# EAGLE schematic circuit-board (EAGLE 8.6.3)
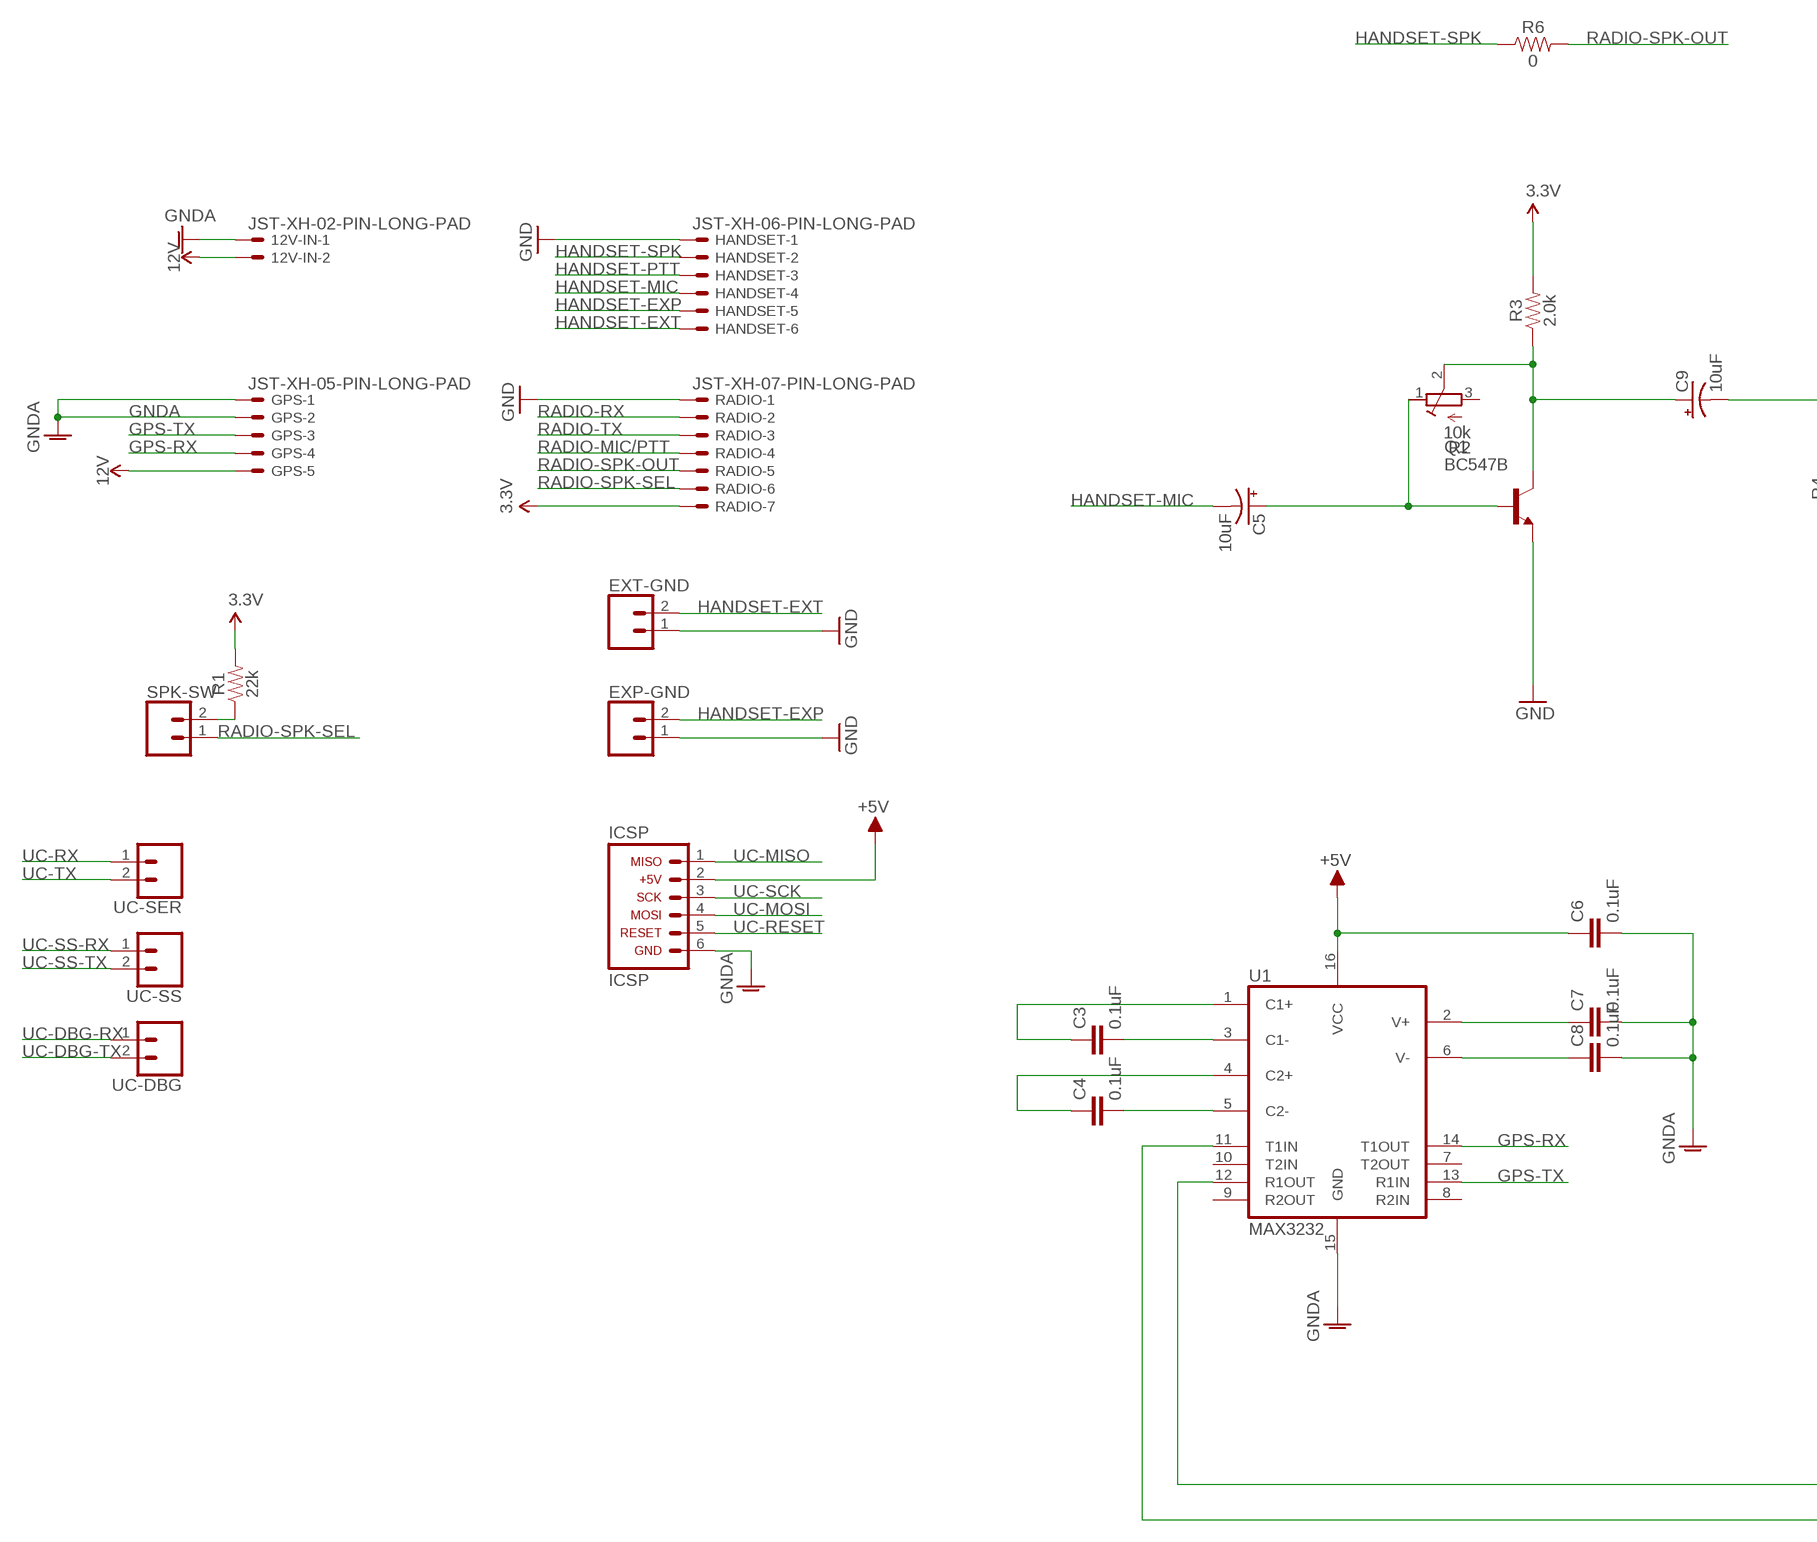
[diagram p0: schematic, sheet 1, part 1 of 2]
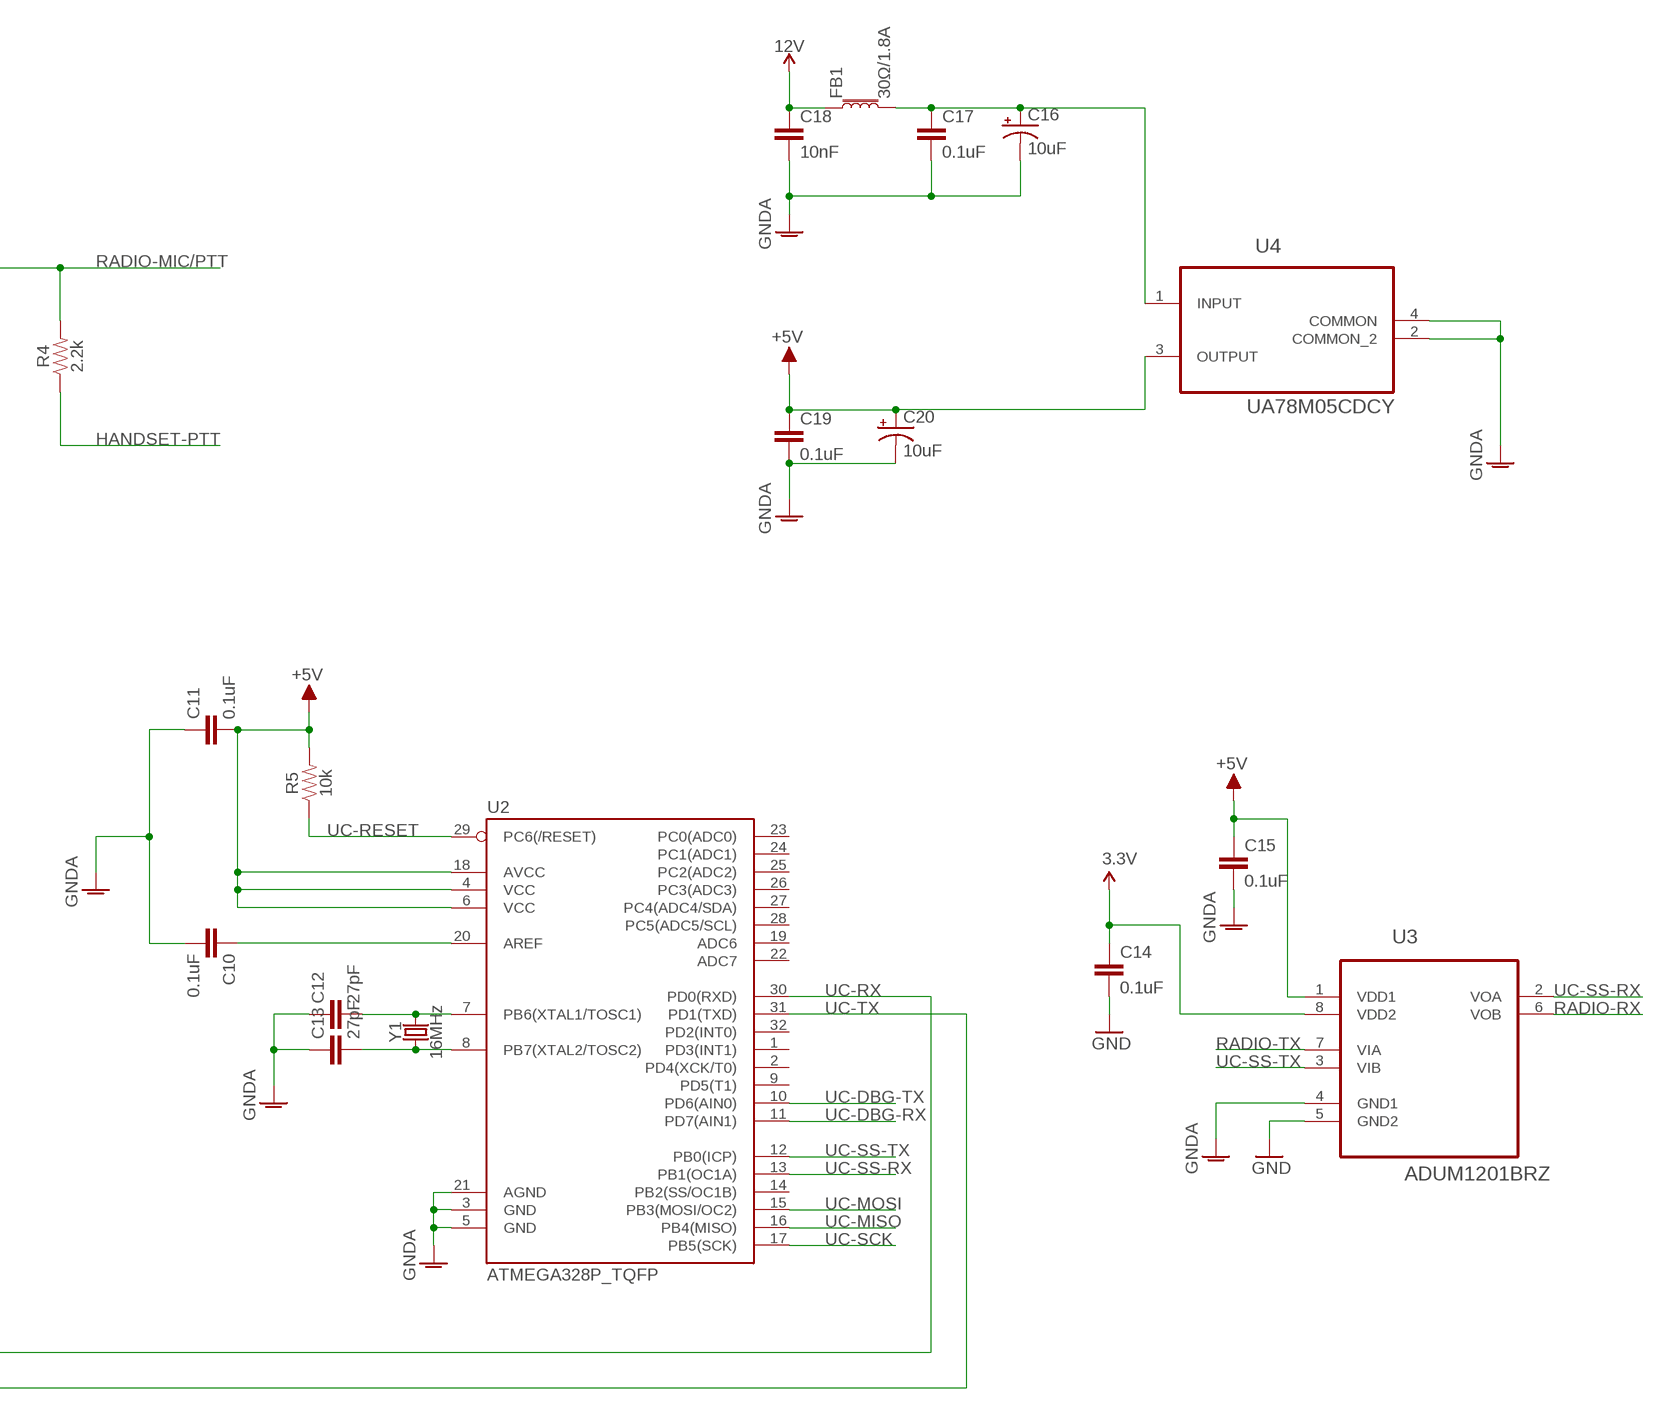
[diagram p1: schematic, sheet 1, part 2 of 2]

## Parts
12V-IN  JST-XH-02-PIN-LONG-PAD  [JST-XH-02-PACKAGE-LONG-PAD]
C3  0.1uF  0.1UF-0603-25V-5%  [0603]
C4  0.1uF  0.1UF-0603-25V-5%  [0603]
C5  10uF  CPOL-USE2.5-5  [E2,5-5]
C6  0.1uF  0.1UF-0603-25V-5%  [0603]
C7  0.1uF  0.1UF-0603-25V-5%  [0603]
C8  0.1uF  0.1UF-0603-25V-5%  [0603]
C9  10uF  CPOL-USE2.5-5  [E2,5-5]
C10  0.1uF  0.1UF-0603-25V-5%  [0603]
C11  0.1uF  0.1UF-0603-25V-5%  [0603]
C12  27pF  27PF-0603-50V-5%  [0603]
C13  27pF  27PF-0603-50V-5%  [0603]
C14  0.1uF  0.1UF-0603-25V-5%  [0603]
C15  0.1uF  0.1UF-0603-25V-5%  [0603]
C16  10uF  CPOL-USE2.5-5  [E2,5-5]
C17  0.1uF  0.1UF-0603-25V-5%  [0603]
C18  10nF  10NF-0603-50V-10%  [0603]
C19  0.1uF  0.1UF-0603-25V-5%  [0603]
C20  10uF  CPOL-USE2.5-5  [E2,5-5]
EXP-GND  CONN_02  [1X02]
EXT-GND  CONN_02  [1X02]
FB1  30Ω/1.8A  FERRITE_BEAD-0603  [0603]
GPS  JST-XH-05-PIN-LONG-PAD  [JST-XH-05-PACKAGE-LONG-PAD]
HANDSET  JST-XH-06-PIN-LONG-PAD  [JST-XH-06-PACKAGE-LONG-PAD]
ICSP  ARDUINO_CONN-ICSP  [CONN-2X03]
Q1  BC547B  [TO92]
R1  22k  22KOHM-0603-1/10W-1%  [0603]
R2  10k  R-TRIMMT93YA  [RTRIMT93YA]
R3  2.0k  2.0KOHM-0603-1/10W-5%  [0603]
R4  2.2k  2.2KOHM-0603-1/10W-1%  [0603]
R5  10k  10KOHM-0603-1/10W-1%  [0603]
R6  0  0OHM-0603-1/10W-5%  [0603]
RADIO  JST-XH-07-PIN-LONG-PAD  [JST-XH-07-PACKAGE-LONG-PAD]
SPK-SW  CONN_02  [1X02]
U1  MAX3232  MAX2323SOIC16  [SO16]
U2  ATMEGA328P_TQFP  [TQFP32-08]
U3  ADUM1201BRZ  [SOIC127P600X175-8N]
U4  UA78M05CDCY  [SOT230P700X180-4N]
UC-DBG  CONN_02  [1X02]
UC-SER  CONN_02  [1X02]
UC-SS  CONN_02  [1X02]
Y1  16MHz  CRYSTAL-16MHZPTH-HC49US  [HC49US]

## Nets
3.3V: C14.1 R1.2 R3.2 RADIO.7 U3.8(VDD2)
12V: 12V-IN.2 C18.1 FB1.1 GPS.5
+5V: C6.1 C11.2 C15.1 C19.1 C20.+ ICSP.2 R5.2 U1.16(VCC) U2.4(VCC) U2.6(VCC) U2.18(AVCC) U3.1(VDD1) U4.3(OUTPUT)
GND: C14.2 EXP-GND.1 EXT-GND.1 HANDSET.1 Q1.1(E) RADIO.1 U3.5(GND2)
GNDA: 12V-IN.1 C6.2 C7.2 C8.2 C10.2 C11.1 C12.1 C13.1 C15.2 C16.- C17.2 C18.2 C19.2 C20.- GPS.1 GPS.2 ICSP.6 U1.15(GND) U2.3(GND) U2.5(GND) U2.21(AGND) U3.4(GND1) U4.2(COMMON_2) U4.4(COMMON)
GPS-RX: GPS.4 U1.14(T1OUT)
GPS-TX: GPS.3 U1.13(R1IN)
HANDSET-EXP: EXP-GND.2 HANDSET.5
HANDSET-EXT: EXT-GND.2 HANDSET.6
HANDSET-MIC: C5.- HANDSET.4
HANDSET-PTT: HANDSET.3 R4.1
HANDSET-SPK: HANDSET.2 R6.1
N$1: C16.+ C17.1 FB1.2 U4.1(INPUT)
N$3: C9.+ Q1.3(C) R2.2(S) R3.1
N$4: C5.+ Q1.2(B) R2.1(E)
N$12: R1.1 SPK-SW.2
N$15: C3.2 U1.3(C1-)
N$16: C3.1 U1.1(C1+)
N$17: C4.2 U1.5(C2-)
N$18: C4.1 U1.4(C2+)
N$20: C7.1 U1.2(V+)
N$21: C8.1 U1.6(V-)
N$22: C10.1 U2.20(AREF)
N$23: C12.2 U2.7(PB6(XTAL1/TOSC1)) Y1.2
N$24: C13.2 U2.8(PB7(XTAL2/TOSC2)) Y1.1
RADIO-MIC/PTT: C9.- R4.2 RADIO.4
RADIO-RX: RADIO.2 U3.6(VOB)
RADIO-SPK-OUT: R6.2 RADIO.5
RADIO-SPK-SEL: RADIO.6 SPK-SW.1
RADIO-TX: RADIO.3 U3.7(VIA)
UC-DBG-RX: U2.11(PD7(AIN1)) UC-DBG.1
UC-DBG-TX: U2.10(PD6(AIN0)) UC-DBG.2
UC-MISO: ICSP.1 U2.16(PB4(MISO))
UC-MOSI: ICSP.4 U2.15(PB3(MOSI/OC2))
UC-RESET: ICSP.5 R5.1 U2.29(PC6(/RESET))
UC-RX: U1.12(R1OUT) U2.30(PD0(RXD)) UC-SER.1
UC-SCK: ICSP.3 U2.17(PB5(SCK))
UC-SS-RX: U2.13(PB1(OC1A)) U3.2(VOA) UC-SS.1
UC-SS-TX: U2.12(PB0(ICP)) U3.3(VIB) UC-SS.2
UC-TX: U1.11(T1IN) U2.31(PD1(TXD)) UC-SER.2
Unconnected: R2.3(A) U1.7(T2OUT) U1.8(R2IN) U1.9(R2OUT) U1.10(T2IN) U2.1(PD3(INT1)) U2.2(PD4(XCK/T0)) U2.9(PD5(T1)) U2.14(PB2(SS/OC1B)) U2.19(ADC6) U2.22(ADC7) U2.23(PC0(ADC0)) U2.24(PC1(ADC1)) U2.25(PC2(ADC2)) U2.26(PC3(ADC3)) U2.27(PC4(ADC4/SDA)) U2.28(PC5(ADC5/SCL)) U2.32(PD2(INT0))

## Library data of the parts
12V-IN = Rembrandt Electronics - JST XH Connectors v1-0:JST-XH-02-PIN: JST XH Connector 2 Pin Wire to board connector. Pitch: 2,54 mm, (0.100") Number of pins: 2 Created by Rembrandt Electronics www.rembrandtelectronics.com
C3 C4 C6-C8 C10 C11 C14 C15 C17 C19 = SparkFun-Capacitors:0.1UF: 0.1µF ceramic capacitors A capacitor is a passive two-terminal electrical component used to store electrical energy temporarily in an electric field.; PROD_ID: CAP-08604
C5 C9 C16 C20 = adafruit:CPOL-US: POLARIZED CAPACITOR, American symbol
C12 C13 = SparkFun-Capacitors:27PF: 27pF ceramic capacitors A capacitor is a passive two-terminal electrical component used to store electrical energy temporarily in an electric field.; PROD_ID: CAP-09989
C18 = SparkFun-Capacitors:10NF: 0.01uF/10nF/10,000pF ceramic capacitors A capacitor is a passive two-terminal electrical component used to store electrical energy temporarily in an electric field. CAP-09321; PROD_ID: CAP-00867
EXP-GND EXT-GND SPK-SW UC-DBG UC-SER UC-SS = SparkFun-Connectors:CONN_02: Multi connection point. Often used as Generic Header-pin footprint for 0.1 inch spaced/style header connections On any of the 0.1 inch spaced packages, you can populate with these: Break Away Headers - Straight <https://www.sparkfun.com/products/116> (PRT-00116) Break Away Male Headers - Right Angle <https://www.sparkfun.com/products/553> (PRT-00553) Female Headers <https://www.sparkfun.com/products/115> (PRT-00115) Break Away Headers - Machine Pin <https://www.sparkfun.com/products/117> (PRT-00117) Break Away Female Headers - Swiss Machine Pin <https://www.sparkfun.com/products/743> (PRT-00743) For SCREWTERMINALS and SPRING TERMINALS visit here: Screw Terimnals on SparkFun.com <https://www.sparkfun.com/search/results?term=Screw+Terminals> (5mm/3.5mm/2.54mm spacing) This device is also useful as a general connection point to wire up your design to another part of your project. Our various solder wires solder well into these plated through hole pads. Hook-Up Wire - Assortment (Stranded, 22 AWG) <https://www.sparkfun.com/products/11375> (PRT-11375) Hook-Up Wire - Assortment (Solid Core, 22 AWG) <https://www.sparkfun.com/products/11367> (PRT-11367) View the entire wire category on our website here <https://www.sparkfun.com/categories/141> Special notes: Molex polarized connector foot print use with: PRT-08233 with associated crimp pins and housings. 2.54_SCREWTERM for use with PRT-10571. 3.5mm Screw Terminal footprints for PRT-08084 5mm Screw Terminal footprints for use with PRT-08432
FB1 = SparkFun-Coils:FERRITE_BEAD: Ferrite Bead (blocks, cores, rings, chokes, etc.) Inductor with layers of ferrite used to suppress high frequencies. Often used to isolate high frequency noise. SparkFun Products: IOIO-OTG - V2.2 <https://www.sparkfun.com/products/13613> SparkFun SAMD21 Mini Breakout <https://www.sparkfun.com/products/13664> SparkFun 6 Degrees of Freedom Breakout - LSM6DS3 <https://www.sparkfun.com/products/13339> SparkFun SAMD21 Dev Breakout <https://www.sparkfun.com/products/13672>; PROD_ID: NDUC-07859
GPS = Rembrandt Electronics - JST XH Connectors v1-0:JST-XH-05-PIN: JST XH Connector 2 Pin Wire to board connector. Pitch: 2,54 mm, (0.100") Number of pins: 5 Created by Rembrandt Electronics www.rembrandtelectronics.com
HANDSET = Rembrandt Electronics - JST XH Connectors v1-0:JST-XH-06-PIN: JST XH Connector 2 Pin Wire to board connector. Pitch: 2,54 mm, (0.100") Number of pins: 6 Created by Rembrandt Electronics www.rembrandtelectronics.com
ICSP = arduino_jw:ARDUINO_CONN-ICSP: Arduino ICSP I/O Header This is the ICSP I/O header on the Arduino Uno R3. This connector is labeled with the following pin assignments: MISO +5V SCK MOSI RESET GND NOTE: Be sure you install this connector with the correct orientation on your PCB layout. Pin 1 has a square pad to assist with orientation.
Q1 = transistor-npn:BC547*: NPN Transistor
R1 = SparkFun-Resistors:22KOHM: 22kΩ resistor A resistor is a passive two-terminal electrical component that implements electrical resistance as a circuit element. Resistors act to reduce current flow, and, at the same time, act to lower voltage levels within circuits. - Wikipedia; PROD_ID: RES-07853
R2 = resistor:R-TRIMM: Trimm resistor
R3 = SparkFun-Resistors:2.0KOHM: 2kΩ resistor A resistor is a passive two-terminal electrical component that implements electrical resistance as a circuit element. Resistors act to reduce current flow, and, at the same time, act to lower voltage levels within circuits. - Wikipedia; PROD_ID: RES-08296
R4 = SparkFun-Resistors:2.2KOHM: 2.2kΩ resistor A resistor is a passive two-terminal electrical component that implements electrical resistance as a circuit element. Resistors act to reduce current flow, and, at the same time, act to lower voltage levels within circuits. - Wikipedia; PROD_ID: RES-08272
R5 = SparkFun-Resistors:10KOHM: 10kΩ resistor A resistor is a passive two-terminal electrical component that implements electrical resistance as a circuit element. Resistors act to reduce current flow, and, at the same time, act to lower voltage levels within circuits. - Wikipedia; PROD_ID: RES-00824
R6 = SparkFun-Resistors:0OHM: 0Ω resistor A resistor is a passive two-terminal electrical component that implements electrical resistance as a circuit element. Resistors act to reduce current flow, and, at the same time, act to lower voltage levels within circuits. - Wikipedia; PROD_ID: RES-08609
RADIO = Rembrandt Electronics - JST XH Connectors v1-0:JST-XH-07-PIN: JST XH Connector 2 Pin Wire to board connector. Pitch: 2,54 mm, (0.100") Number of pins: 7 Created by Rembrandt Electronics www.rembrandtelectronics.com
U1 = SparkFun-IC-Comms:MAX2323: RS232 Transceiver This part covers 232 drivers that are compatible with the MAX3232. Sipex SP3232EB Datasheet <http://cdn.sparkfun.com/datasheets/Components/General%20IC/SP3232EBCA-L.pdf> SparkFun Products SOIC component <https://www.sparkfun.com/products/589> (COM-00589 / IC-08171) Retired DIP component (COM-00316 / IC-08446) SparkFun Transceiver Breakout - MAX3232 <https://www.sparkfun.com/products/11189> (BOB-11189) SparkFun XBee Explorer Serial <https://www.sparkfun.com/products/13225> (WRL-13225); PROD_ID: IC-08171
U2 = SparkFun-IC-Microcontroller:ATMEGA328P_TQFP: Popular 328P in QFP Storefront component: ATmega328 - TQFP <https://www.sparkfun.com/products/13448> (COM-13448) Datasheet <http://www.sparkfun.com/datasheets/Components/SMD/ATMega328.pdf> SparkFun Products SparkFun RedBoard - Programmed with Arduino <https://www.sparkfun.com/products/12757> (DEV-12757) Arduino Pro Mini 328 - 5V/16MHz <https://www.sparkfun.com/products/11113> (DEV-11113) Arduino Pro Mini 328 - 3.3V/8MHz <https://www.sparkfun.com/products/11114> (DEV-11114) SparkFun OpenLog <https://www.sparkfun.com/products/13712> (DEV-13712) SparkFun MicroView - OLED Arduino Module <https://www.sparkfun.com/products/12923> (DEV-12923) SparkFun Digital Sandbox <https://www.sparkfun.com/products/12651> (DEV-12651) SparkFun PicoBoard <https://www.sparkfun.com/products/11888> (WIG-11888) Arduino Fio <https://www.sparkfun.com/products/10116> (DEV-10116) LilyPad Arduino 328 Main Board <https://www.sparkfun.com/products/13342> (DEV-13342) SparkFun RedStick <https://www.sparkfun.com/products/13741> (DEV-13741) LilyPad MP3 <https://www.sparkfun.com/products/11013> (DEV-11013) LilyPad Arduino SimpleSnap <https://www.sparkfun.com/products/10941> (DEV-10941) SparkFun Stepoko <https://www.sparkfun.com/products/13899> (ROB-13899) SparkFun Geiger Counter <https://www.sparkfun.com/products/11345> (SEN-11345) SparkFun EL Sequencer <https://www.sparkfun.com/products/12781> (COM-12781) Arduino Pro 328 - 5V/16MHz <https://www.sparkfun.com/products/10915> (DEV-10915) CryptoCape <https://www.sparkfun.com/products/12773> (DEV-12773) SparkFun IR Thermometer Evaluation Board - MLX90614 <https://www.sparkfun.com/products/10740> (SEN-10740) SparkFun RedBot Mainboard <https://www.sparkfun.com/products/12097> (ROB-12097) Arduino Pro 328 - 3.3V/8MHz <https://www.sparkfun.com/products/10914> (DEV-10914) SparkFun Block for Intel® Edison - Arduino <https://www.sparkfun.com/products/13036> (DEV-13036) SparkFun Simon Says - Surface Mount Soldering Kit <https://www.sparkfun.com/products/10935> (KIT-10935) SparkFun 7-Segment Serial Display - Red <https://www.sparkfun.com/products/11441> (COM-11441) SparkFun 7-Segment Serial Display - White <https://www.sparkfun.com/products/11629> (COM-11629) SparkFun 7-Segment Serial Display - Yellow <https://www.sparkfun.com/products/11443> (COM-11443) SparkFun 7-Segment Serial Display - Kelly Green <https://www.sparkfun.com/products/11440> (COM-11440) SparkFun 7-Segment Serial Display - Blue <https://www.sparkfun.com/products/11442> (COM-11442) SparkFun OpenSegment Serial Display - 20mm (Blue) <https://www.sparkfun.com/products/11647> (COM-11647) SparkFun OpenSegment Serial Display - 20mm (Green) <https://www.sparkfun.com/products/11646> (COM-11646) SparkFun OpenSegment Serial Display - 20mm (White) <https://www.sparkfun.com/products/11648> (COM-11648) SparkFun OpenSegment Serial Display - 20mm (Red) <https://www.sparkfun.com/products/11644> (COM-11644) SparkFun OpenSegment Serial Display - 20mm (Yellow) <https://www.sparkfun.com/products/11645> (COM-11645) SparkFun OpenSegment Shield <https://www.sparkfun.com/products/13190> (DEV-13190); PROD_ID: IC-09069
U3 = Analog Devices_By_element14_Batch_1:ADUM1201BRZ: Dual-Channel Digital Isolators; MPN: ADUM1201BRZ; OC_FARNELL: 1078201; OC_NEWARK: 19M8748; PACKAGE: SOIC-8; SUPPLIER: Analog Devices
U4 = Texas Instruments_By_element14_Batch_1:UA78M05CDCY: IC, LINEAR VOLT REGULATOR, 5V; MPN: UA78M05CDCY; OC_FARNELL: 1575761; OC_NEWARK: 77C1885; PACKAGE: SOT-223-3; SUPPLIER: TEXAS INSTRUMENTS
Y1 = SparkFun-Clocks:CRYSTAL-16MHZ: 16MHz Crystal Digikey Example <http://www.digikey.com/product-search/en?keywords=535-9122-1-ND> Frequency: 16MHz Frequency Stability: ±50ppm Frequency Tolerance: ±20ppm Load Capacitance: 18pF SparkFun Products: Pro Micro -5V/16MHz <https://www.sparkfun.com/products/12640> SparkFun Serial Enabled LCD Kit <https://www.sparkfun.com/products/10097>; PROD_ID: XTAL-08181; SF_ID: COM-00536